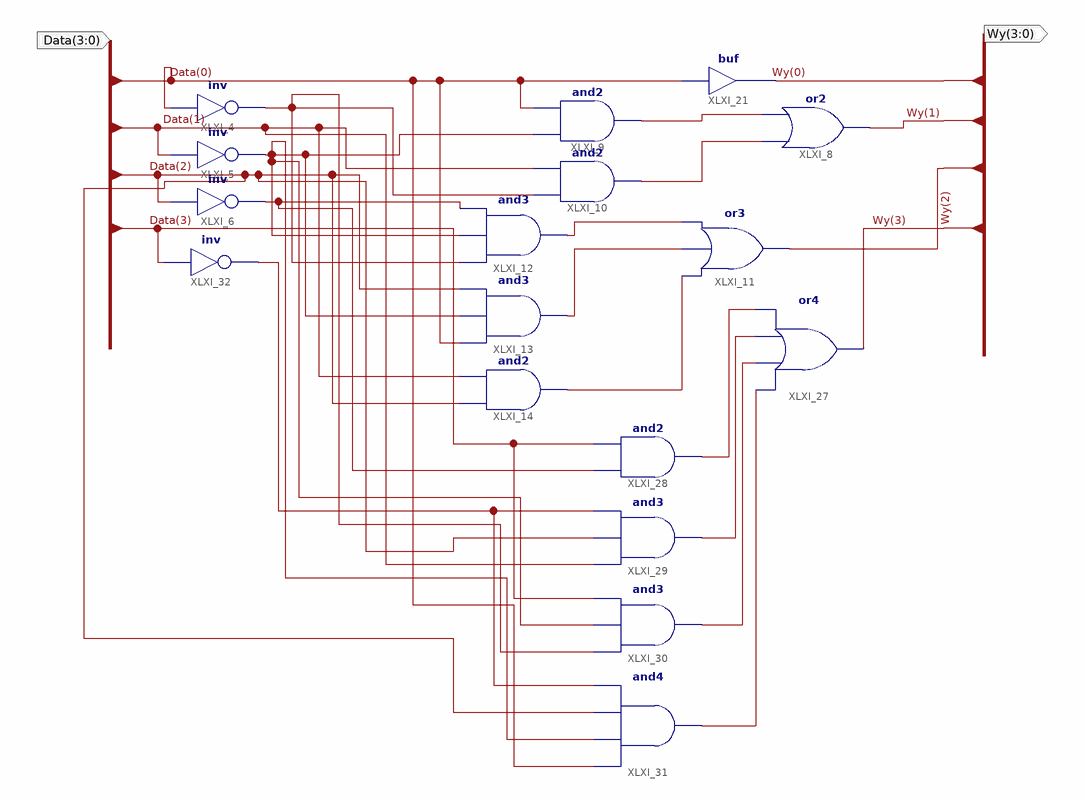
[diagram p0: schematic sheet 1]
// Xilinx ISE schematic schemat.sch (xc9500xl) as structural Verilog: 17 symbols, 2 ports
module schemat (
  input  [3:0] Data,
  output [3:0] Wy
);

  wire XLXN_19, XLXN_20, XLXN_26, XLXN_27, XLXN_28, XLXN_29, XLXN_31, XLXN_32, XLXN_54, XLXN_55, XLXN_56,
       XLXN_57, XLXN_61;

  not XLXI_4 (XLXN_31, Data[0]);
  not XLXI_5 (XLXN_32, Data[1]);
  not XLXI_6 (XLXN_29, Data[2]);
  or XLXI_8 (Wy[1], XLXN_20, XLXN_19);
  and XLXI_9 (XLXN_19, XLXN_32, Data[0]);
  and XLXI_10 (XLXN_20, XLXN_31, Data[1]);
  or XLXI_11 (Wy[2], XLXN_28, XLXN_27, XLXN_26);
  and XLXI_12 (XLXN_26, XLXN_31, XLXN_32, XLXN_29);
  and XLXI_13 (XLXN_27, Data[0], XLXN_32, Data[2]);
  and XLXI_14 (XLXN_28, Data[2], Data[1]);
  buf XLXI_21 (Wy[0], Data[0]);
  or XLXI_27 (Wy[3], XLXN_57, XLXN_56, XLXN_55, XLXN_54);
  and XLXI_28 (XLXN_54, XLXN_29, Data[3]);
  and XLXI_29 (XLXN_55, Data[1], Data[2], XLXN_61);
  and XLXI_30 (XLXN_56, XLXN_31, XLXN_32, Data[3]);
  and XLXI_31 (XLXN_57, Data[0], XLXN_32, Data[2], XLXN_61);
  not XLXI_32 (XLXN_61, Data[3]);
endmodule
